# Altium schematic sheet solar.SchDoc
size A; SheetNumber: 1; SheetTotal: 1
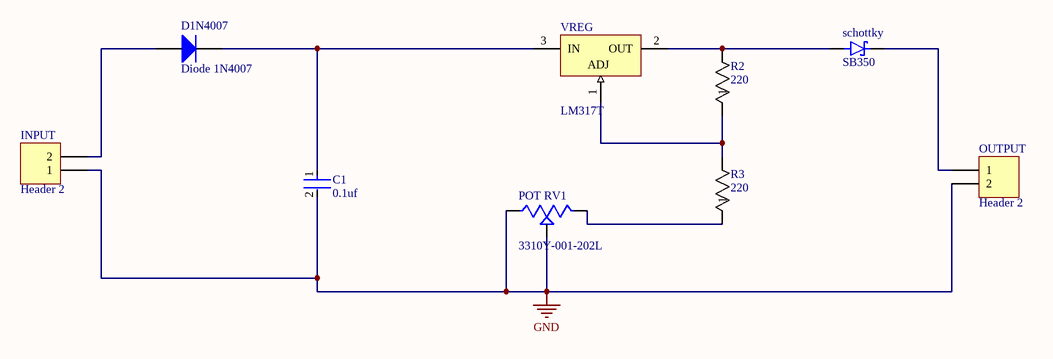
[diagram p0: solar.SchDoc]

## Parts
C1  0.1uf  [FP-RDE0M1-MFG]
D1N4007  Diode 1N4007  [DO-41]
INPUT  Header 2  [HDR1X2]
OUTPUT  Header 2  [HDR1X2]
POT_RV1  3310Y-001-202L  [TRIM_3310Y-001-202L]
R2  220  [RES_AC01_VIS]
R3  220  [RES_AC01_VIS]
schottky  SB350  [DIOAD1990W125L950D560]
VREG  LM317T  [NDE0003A]

## Nets
GND: C1.2 INPUT.1 OUTPUT.2 POT_RV1.1(CCW) POT_RV1.2(WIPER)
NetC1_1: C1.1 D1N4007.2(K) VREG.3(IN)
NetD1N4007_1: D1N4007.1(A) INPUT.2
NetOUTPUT_1: OUTPUT.1 schottky.C(K)
NetPOT_RV1_3: POT_RV1.3(CW) R3.1
NetR2_1: R2.1 R3.2 VREG.1(ADJ)
NetR2_2: R2.2 schottky.A VREG.2(OUT)

## Library data of the parts
C1 = CMP-06035-051680-1: Ceramic Capacitor 100nF ±10% 50V X7R Radial; Lead/Base Style: Kinked; Lead Diameter: 0.5mm; Lead Free: Lead Free; Mount: Through Hole; Package Quantity: 2000; Lead Pitch: 0.197inch; Capacitance: 100nF; Case/Package: Radial; Tolerance: 10%; Height - Seated (Max): 0.236inch; Max Operating Temperature: 125°C; Dielectric: X7R; Min Operating Temperature: -55°C; Voltage Rating (DC): 50V; Voltage Rating: 50V; Termination: Radial; Height: 3.5mm; Resistor Type: Ceramic; Width: 3.5mm; Packaging: Tape and Reel; Length: 0.157inch
D1N4007 = Diode 1N4007: 1 Amp General Purpose Rectifier; Published: 8-Jun-2000; LatestRevisionDate: 17-Jul-2002; LatestRevisionNote: Re-released for DXP Platform.; DatasheetVersion: 1998; PackageVersion: Aug-1999; PackageReference: DO-41; Publisher: Altium Limited; PackageDescription: Diode, Axial; Body 5.2 x 2.7 mm (LxDia. max), Lead Dia. 0.86 mm (max); Code_JEDEC: DO-204-AL; ComponentLink1Description: Manufacturer Link; ComponentLink1URL: http://www.fairchildsemi.com/; ComponentLink2Description: Datasheet; ComponentLink2URL: http://www.fairchildsemi.com/ds/1N%2F1N4001.pdf
INPUT OUTPUT = Header 2: Header, 2-Pin; LatestRevisionDate: 17-Jul-2002; LatestRevisionNote: Re-released for DXP Platform.; Publisher: Altium Limited
POT_RV1 = 3310Y-001-202L: Potentiometer Conductive Plastic 2k Power 0.25W Shaft Dia 0.125In 3310 Series | Bourns 3310Y-001-202L; SnapEDA_Link: https://www.snapeda.com/parts/3310Y-001-202L/Bourns+-+J.W.+Miller/view-part/?ref=snap; Package: None; Value: *; MF: Bourns; MP: 3310Y-001-202L; Check_prices: https://www.snapeda.com/parts/3310Y-001-202L/Bourns+-+J.W.+Miller/view-part/?ref=eda
R2 R3 = CMP-00030-39747107-1: AC01000006809JA100 Resistor, 68 Ohm, ± 5%, 1 W, Axial Leaded, Wirewound, General Purpose; Resistance: 68Ω; Max Power Dissipation: 1W; Lead Diameter: 800µm; Temperature Coefficient: 180ppm/°C; Voltage Rating (DC): 8V; Min Operating Temperature: -40°C; Tolerance: 5%; Max Operating Temperature: 275°C; Contact Plating: Tin; Diameter: 4.3mm; Power Rating: 1W; RoHS: Compliant; Packaging: Tape & Box (TB); Length: 11mm; REACH SVHC: Unknown; NexarPartId: 39747107; Number of Terminations: 2; Composition: Wirewound; Features: Flame Retardant Coating; Number of Pins: 2; Termination: Axial; Schedule B: 8533210080, 8533210080; Case/Package: Axial
schottky = SB350: Diode Schottky 60V 3A Through Hole DO-201AD; MF: ON Semiconductor; Check_prices: https://www.snapeda.com/parts/SB350/ON%20Semiconductor/view-part/4995705/?ref=eda; Package: AXIAL LEAD-2 ON Semiconductor; Price: None; SnapEDA_Link: https://www.snapeda.com/parts/SB350/ON%20Semiconductor/view-part/4995705/?ref=snap; Availability: Warning; Purchase-URL: https://pricing.snapeda.com/search/part/SB350/?ref=eda; Value: *; MP: SB350
VREG = CMP-0062-02456-3: 3-Terminal Adjustable Regulator, 3-pin TO-220; Manufacturer: Texas Instruments; CompType: LDO IC; PowerWise: N; PackageTopMarking: NSUZXYTTE#*LM317T P+; ComponentLink1Description: Datasheet URL; PackageReference: NDE0003A; PinCount: 3; ComponentLink1URL: http://www.ti.com/general/docs/lit/getliterature.tsp?genericPartNumber=LM317-N&fileType=pdf; RoHS: N; PackageDescription: TO-220, Molded, 3 Lead, Straight